# Altium schematic sheet Voltmeter_Schematic.SchDoc
size A; SheetNumber: 1; SheetTotal: 1
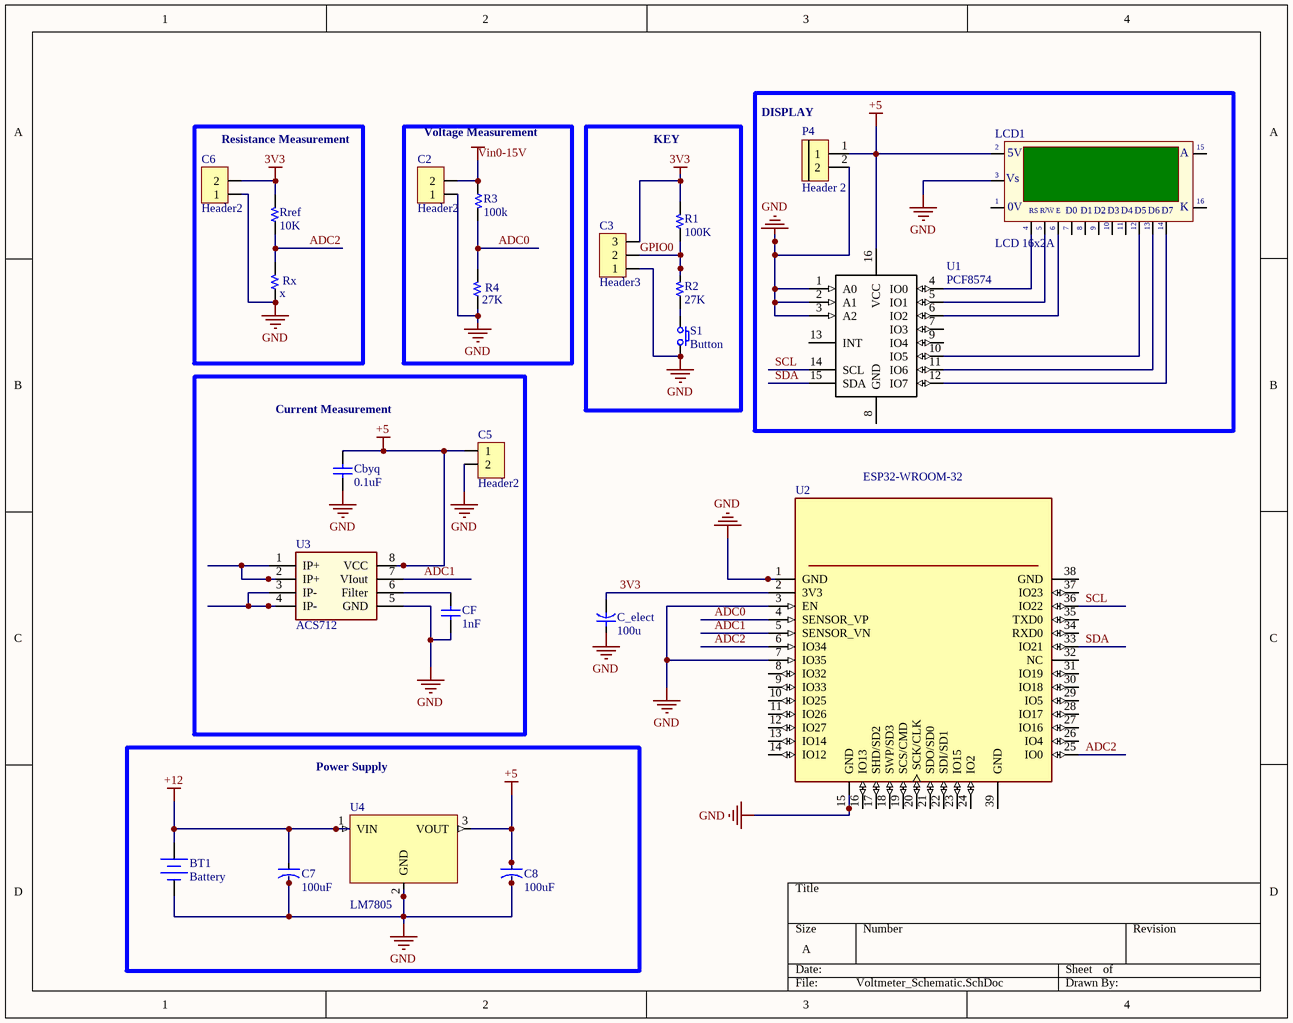
[diagram p0: Voltmeter_Schematic.SchDoc]

## Parts
BT1  Battery  [CON CR1220]
C2  Header2  [HDR2]
C3  Header3  [HDR3]
C5  Header2  [HDR2]
C6  Header2  [HDR2]
C7  100uF  [CA-ALU-2.54]
C8  100uF  [CA-ALU-2.54]
C_elect  100u  [C Super Case A]
Cbyq  0.1uF  [C 0805]
CF  1nF  [C 0805]
LCD1  LCD 16x2A  [JP16-C1T]
P4  Header 2  [BIG_Header 2]
R1  100K  [R 0805]
R2  27K  [R 0805]
R3  100k  [R 0805]
R4  27K  [R 0805]
Rref  10K  [R 0805]
Rx  x  [R 0805]
S1  Button  [SW/2/DIP]
U1  PCF8574  [DIP16]
U2  ESP32-WROOM-32  [MODULE_ESP32-WROOM-32]
U3  ACS712  [SOIC-8]
U4  LM7805  [TO-220]

## Blocks framed on the sheet
DISPLAY: LCD1 P4 U1
Resistance Measurement: C6 Rref Rx
Voltage Measurement: C2 R3 R4
KEY: C3 R1 R2 S1
Current Measurement: C5 Cbyq CF U3
Power Supply: BT1 C7 C8 U4

## Nets
3V3: C3.3 C6.2 C_elect.2 R1.2 Rref.2 U2.2(3V3)
+5: C5.1 C8.1 Cbyq.1 LCD1.2(VDD) P4.1 U1.16(VCC) U3.8(VCC) U4.3(VOUT)
+12: BT1.1(V+) C7.1 U4.1(VIN)
GND: BT1.2(V-) C2.1 C3.1 C5.2 C6.1 C7.2 C8.2 Cbyq.2 CF.2 LCD1.3(VEE) P4.2 R4.1 Rx.1 S1.2 U1.1(A0) U1.2(A1) U1.3(A2) U2.1(GND) U2.3(EN) U2.7(IO35) U2.15(GND) U3.5(GND) U4.2(GND)
Vin0-15V: C2.2 R3.1
ADC0: R3.2 R4.2 U2.4(SENSOR_VP)
ADC1: U2.5(SENSOR_VN) U3.7(VIout)
ADC2: Rref.1 Rx.2 U2.6(IO34) U2.25(IO0)
GPIO0: C3.2 R1.1 R2.2
SCL: U1.14(SCL) U2.36(IO22)
SDA: U1.15(SDA) U2.33(IO21)
NetCF_1: CF.1 U3.6(Filter)
NetLCD1_4: LCD1.4(RS) U1.4(IO0)
NetLCD1_5: LCD1.5(R/~{W}) U1.5(IO1)
NetLCD1_6: LCD1.6(~{EN}) U1.6(IO2)
NetLCD1_12: LCD1.12(D5) U1.10(IO5)
NetLCD1_13: LCD1.13(D6) U1.11(IO6)
NetLCD1_14: LCD1.14(D7) U1.12(IO7)
NetR2_1: R2.1 S1.1
NetU3_1: U3.1(IP+) U3.2(IP+)
NetU3_3: U3.3(IP-) U3.4(IP-)

Not connected (* = marked no-connect by the designer): C_elect 1; LCD1 1(GND) 7(D0) 8(D1) 9(D2) 10(D3) 11(D4) 15(A) 16(K); U1 7(IO3) 8(GND) 9(IO4) 13(INT); U2 8(IO32) 9(IO33) 10(IO25) 11(IO26) 12(IO27) 13(IO14) 14(IO12) 16(IO13) 17(SHD/SD2) 18(SWP/SD3) 19(SCS/CMD) 20(SCK/CLK) 21(SDO/SD0) 22(SDI/SD1) 23(IO15) 24(IO2) 26(IO4) 27(IO16) 28(IO17) 29(IO5) 30(IO18) 31(IO19) 32(NC) 34(RXD0) 35(TXD0) 37(IO23) 38(GND) 39(GND)

## Notes on the sheet
- Labels drawn without touching a wire or pin: GND
- (in symbol LCD16x2A) 5V; Vs; |; 0V; R/W; E

## Library data of the parts
C2 C5 C6 = Header2: Header IDC, 2 x 1 Pin Vertical 2.54mm Pitch (Non-Boxed, Male); Manufacturer: W¨¹rth Elektronik eiSos GmbH; partNo: 613002143121; ComponentLink1 Description: Manufacturer; ComponentLink2 Description: Datasheet; NoPins: 02; Created Date: 29 March 2013; ComponentLink1URL: http://www.we-online.com; ComponentLink2URL: http://katalog.we-online.de/em/datasheet/6130xx143121.pdf; Created by: Karrer Zheng
C3 = Header3: Header IDC, 3 x 1 Pin Vertical 2.54mm Pitch (Non-Boxed, Male); Manufacturer: W¨¹rth Elektronik eiSos GmbH; partNo: 613002143121; ComponentLink1 Description: Manufacturer; ComponentLink2 Description: Datasheet; NoPins: 02; Created Date: 29 March 2013; ComponentLink1URL: http://www.we-online.com; ComponentLink2URL: http://katalog.we-online.de/em/datasheet/6130xx143121.pdf; Created by: Karrer Zheng
C7 C8 = CN-ALU-DIP: Capacitor (Semiconductor SIM Model); Value: 104; LatestRevisionDate: 17-Jul-2002; LatestRevisionNote: Re-released for DXP Platform.; PackageReference: C1206; Publisher: Altium Limited
C_elect = Capacitor: Capacitor pol
Cbyq CF = Capacitor NP: Capacitor non-pol
LCD1 = LCD16x2A: LCD dipslay 16 char, 2 line; Value: LCD16x2A
P4 = Header 2: Big Header 2
R1-R4 Rref Rx = Resistor
S1 = SW SPST: Tact switch 2 pin
U1 = PCF8574: I2C PORT EXPANDER; Manufacturer Part Number: PCF8574T/3,512; Manufacturer: NXP Semiconductors; Includes: POR; Interface: I²C; Interrupt Output: Yes; Number of I /O: 8; Voltage - Supply: 2.5 V ~ 6 V; Frequency - Clock: 100KHz; Supplier 1: Digi-Key; Supplier Part Number 1: 568-1076-5-ND; Package / Case: 16-SOIC (7.5mm Width); Category: Integrated Circuits (ICs); Supplier Part Number: 568-1076-5-ND; Operating Temperature: -40°C ~ 85°C; Packaging: Tube; RoHS: RoHS Compliant; Supplier: Digi-Key
U2 = ESP32-WROOM-32: Bluetooth, WiFi 802.11b/g/n, Bluetooth v4.2 + EDR, Class 1, 2 and 3 Transceiver Module 2.4GHz ~ 2.5GHz Integrated, Trace Surface Mount; MF: Espressif Systems; MP: ESP32-WROOM-32D; Price: None; Package: Module Espressif Systems; Availability: Unavailable; SnapEDA_Link: https://www.snapeda.com/parts/ESP32-WROOM-32D/Espressif%20Systems/view-part/2768115/?ref=snap; Value: *
U3 = ACS712: Fully Integrated, Hall Effect-Based Linear Current Sensor IC   with 2.1 kVRMS Isolation and a Low-Resistance Current Conductor
U4 = LM7805: TO-220; Text Field1: 70; Text Field2: 30